# Altium schematic sheet converter.SchDoc
size A4; SheetNumber: 1; SheetTotal: 1
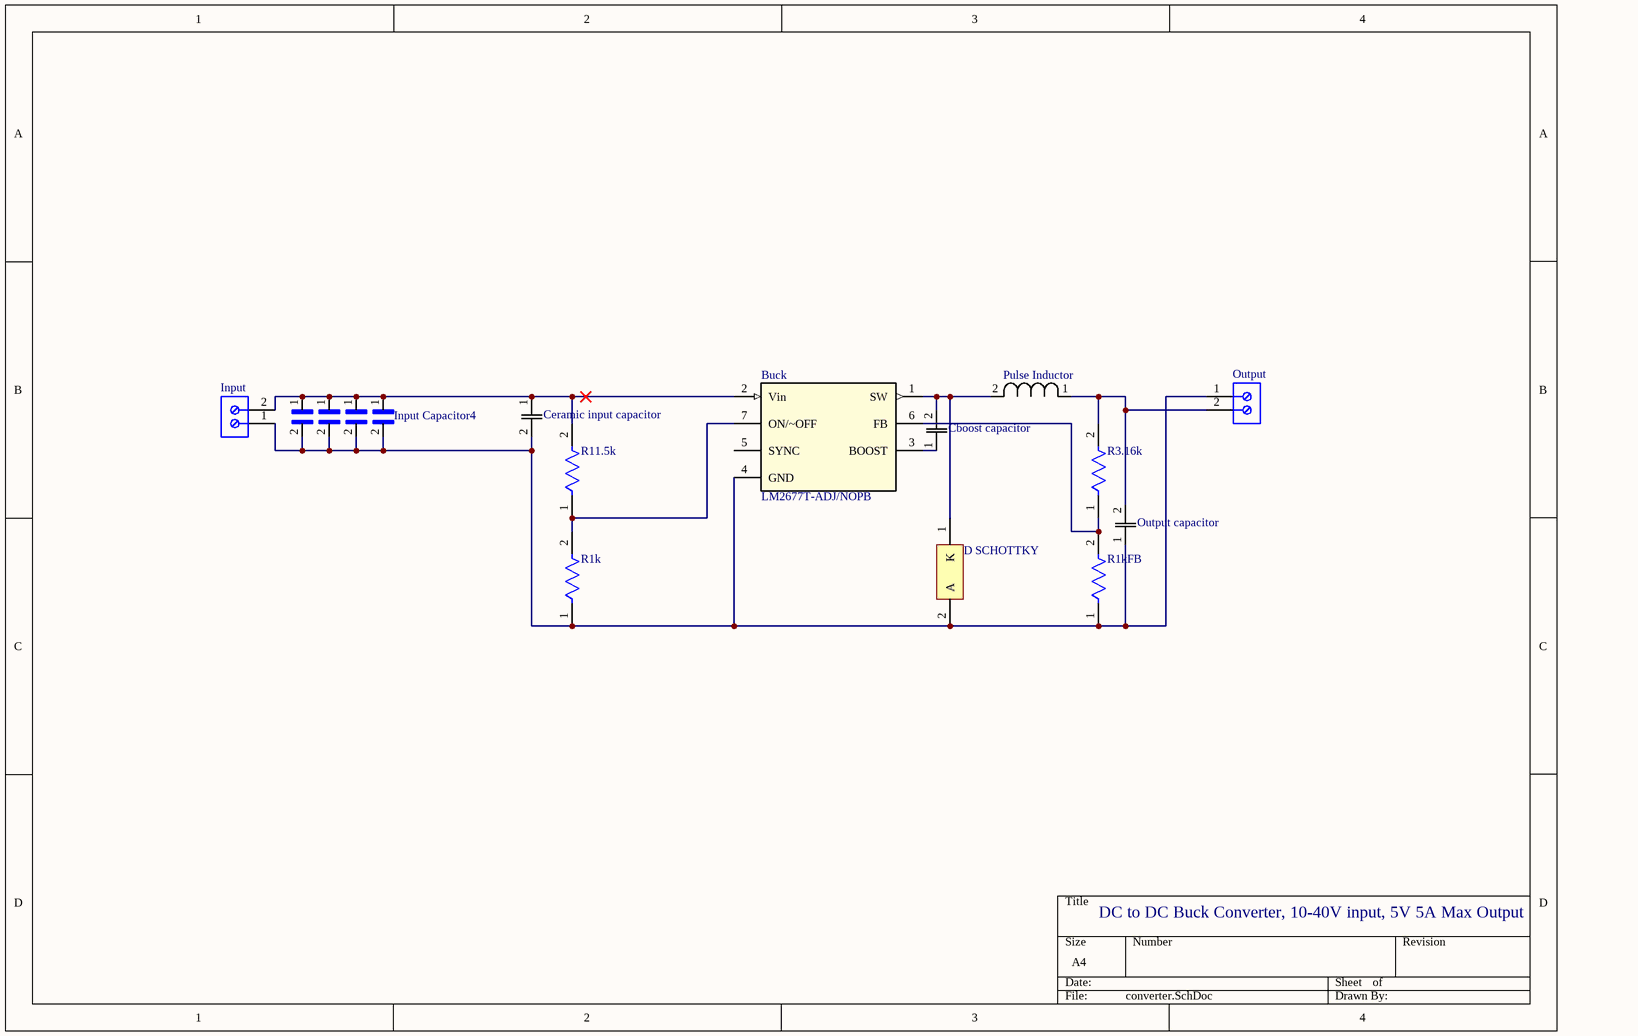
[diagram p0: converter.SchDoc]

## Parts
Buck  LM2677T-ADJ/NOPB  [TA07B]
Cboost_capacitor  VJ1206Y103KXACW1BC  [CAP_VJ1206_VIS]  (value not drawn)
Ceramic_input_capacitor  C0805C334K5RACAUTO  [CAPC220145_100N_KEM]  (value not drawn)
D_SCHOTTKY  80SQ045NRLG  [ONSC-AXIAL_LEAD-2-267-05_V]  (value not drawn)
Input  691137710002  [691137710002]  (value not drawn)
Input_Capacitor1  TPSE156K050R0250  [CAPPM7343X310N]  (value not drawn)
Input_Capacitor2  TPSE156K050R0250  [CAPPM7343X310N]  (value not drawn)
Input_Capacitor3  TPSE156K050R0250  [CAPPM7343X310N]  (value not drawn)
Input_Capacitor4  TPSE156K050R0250  [CAPPM7343X310N]  (value not drawn)
Output  691137710002  [691137710002]  (value not drawn)
Output_capacitor  594D686X9010C2T  [CAP_594D_C_VIS]  (value not drawn)
Pulse_Inductor  PE-54041SNL  [IND_HCI-68_PUL]  (value not drawn)
R1k  CRCW12061K00FKEAHP  [FP-CRCW1206-HPe3-MFG]  (value not drawn)
R1kFB  CRCW12061K00FKEAHP  [FP-CRCW1206-HPe3-MFG]  (value not drawn)
R3.16k  CRCW12063K16FKEA  [FP-CRCW1206-e3-MFG]  (value not drawn)
R11.5k  CRCW120611K5FKEA  [FP-CRCW1206-e3-IPC_C]  (value not drawn)

## Nets
NetBuck_1: Buck.1(SW) Cboost_capacitor.2 D_SCHOTTKY.1(K) Pulse_Inductor.2
NetBuck_2: Buck.2(Vin) Ceramic_input_capacitor.1 Input.2 Input_Capacitor1.1 Input_Capacitor2.1 Input_Capacitor3.1 Input_Capacitor4.1 R11.5k.2
NetBuck_3: Buck.3(BOOST) Cboost_capacitor.1
NetBuck_4: Buck.4(GND) Ceramic_input_capacitor.2 D_SCHOTTKY.2(A) Input.1 Input_Capacitor1.2 Input_Capacitor2.2 Input_Capacitor3.2 Input_Capacitor4.2 Output.1 Output_capacitor.1 R1k.1 R1kFB.1
NetBuck_6: Buck.6(FB) R1kFB.2 R3.16k.1
NetBuck_7: Buck.7(ON/~OFF) R1k.2 R11.5k.1
NetOutput_2: Output.2 Output_capacitor.2 Pulse_Inductor.1 R3.16k.2

Not connected (* = marked no-connect by the designer): Buck 5(SYNC)

## Notes on the sheet
- DC to DC Buck Converter, 10-40V input, 5V 5A Max Output

## Library data of the parts
Buck = LM2677T-ADJ/NOPB: IC REG BUCK ADJ 5A TO220-7; Manufacturer: TI National Semiconductor; Min Input Voltage: 8V; Output Voltage: 37V; Number of Outputs: 1; Max Input Voltage: 40V; Switching Frequency: 260kHz; Quiescent Current: 4.2mA; Output Type: Adjustable; Synchronous Rectifier: No; Efficiency: 84%; Min Output Voltage: 1.21V; Output Configuration: Positive; Supplier 1: Digi-Key; Manufacturer Part Number: LM2677T-ADJ/NOPB; RoHS: Yes; Category: Voltage Regulators - Switching; Stock 1: 20; Pricing 1: 1=6.95000, 10=6.24400, 25=5.90280, 100=5.11580, 250=4.85348, 500=4.35500, 1000=4.33125 (USD); Mount: Through Hole; Case/Package: TO-220; Number of Pins: 7; Min Operating Temperature: -40°C; Max Operating Temperature: 125°C; Packaging: Rail/Tube; Output Current: 5A; Max Output Current: 5A; Package Quantity: 45; Series: SIMPLE SWITCHER®; Operating Supply Voltage: 40V; Max Output Voltage: 37V; Length: 10.16mm; Width: 4.57mm; Height: 8.69mm; Radiation Hardening: No; Lead Free: Lead Free; RoHS Compliant: Yes; ComponentLink1URL: https://datasheet.ciiva.com/6603/lm2677-6603725.pdf?src-supplier=Digi-Key; ComponentLink1Description: https://datasheet.ciiva.com/6603/lm2677-6603725.pdf?src-supplier=Digi-Key; Supplier Part Number 1: LM2677T-ADJ/NOPB-ND
Cboost_capacitor = Cboost capacitor: Cap Ceramic 0.01uF 50V X7R 10% SMD 1206 125C Paper T/R; Manufacturer: Vishay; Capacitance: 10nF; Supplier 1: Digi-Key; Manufacturer Part Number: VJ1206Y103KXACW1BC; RoHS: Yes; Category: Ceramic Capacitors; Stock 1: 755; Pricing 1: 1=0.30000, 10=0.20900, 50=0.13920, 100=0.11830, 500=0.08348, 1000=0.07305 (USD); Mount: Surface Mount; Case/Package: 1206; Case Code (Metric): 3216; Case Code (Imperial): 1206; Min Operating Temperature: -55°C; Max Operating Temperature: 125°C; Package Quantity: 4000; Voltage Rating: 50V; Tolerance: 10%; Packaging: Tape and Reel; Voltage Rating (DC): 50V; Dielectric: X7R; Termination: SMD/SMT; Voltage: 50V; Series: VJ; Construction: Flat; Length: 3.2mm; Width: 0.063inch; Height: 1.9mm; Thickness: 0.037inch; Depth: 1.6mm; Radiation Hardening: No; RoHS Compliant: Yes; ComponentLink1URL: https://datasheet.ciiva.com/178/vjw1bcbascomseries-178176.pdf?src-supplier=Digi-Key; ComponentLink1Description: https://datasheet.ciiva.com/178/vjw1bcbascomseries-178176.pdf?src-supplier=Digi-Key; ComponentLink2URL: https://datasheet.ciiva.com/17445/vjw1bcbascomseries-17445850.pdf?src-supplier=Avnet+Europe; ComponentLink2Description: https://datasheet.ciiva.com/17445/vjw1bcbascomseries-17445850.pdf?src-supplier=Avnet+Europe; ComponentLink3URL: https://datasheet.ciiva.com/16382/vjw1bcbascomseries-16382252.pdf?src-supplier=Future+Electronics; ComponentLink3Description: https://datasheet.ciiva.com/16382/vjw1bcbascomseries-16382252.pdf?src-supplier=Future+Electronics; Supplier Part Number 1: 720-1539-1-ND
Ceramic_input_capacitor = C0805C334K5RACAUTO: Cap Ceramic 0.33uF 50V X7R 10% SMD 0805 125C Paper T/R; Manufacturer: KEMET; Capacitance: 330nF; Supplier 1: Digi-Key; Manufacturer Part Number: C0805C334K5RACAUTO; RoHS: Yes; Category: Ceramic Capacitors; Stock 1: 7177; Pricing 1: 1=0.21000, 10=0.14400, 50=0.08660, 100=0.07320, 500=0.05004, 1000=0.04428 (USD); Mount: Surface Mount; Case/Package: 0805; Case Code (Metric): 2012; Case Code (Imperial): 0805; Contact Plating: Tin,Matte; Dielectric Material: Ceramic; Min Operating Temperature: -55°C; Max Operating Temperature: 125°C; Tolerance: 10%; Voltage Rating: 50V; Packaging: Tape and Reel; Package Quantity: 1; Voltage Rating (DC): 50V; Dielectric: X7R; Termination: SMD/SMT; Series: C; Construction: Flat; Length: 2mm; Width: 0.049inch; Height: 0.9mm; Thickness: 0.039inch; Depth: 1.25mm; Ratings: AEC-Q200; Radiation Hardening: No; REACH SVHC: No SVHC; ComponentLink1URL: https://datasheet.ciiva.com/7842/1776105-7842326.pdf?src-supplier=Element14; ComponentLink1Description: https://datasheet.ciiva.com/7842/1776105-7842326.pdf?src-supplier=Element14; ComponentLink2URL: https://datasheet.ciiva.com/22705/1776105-22705463.pdf?src-supplier=Element14; ComponentLink2Description: https://datasheet.ciiva.com/22705/1776105-22705463.pdf?src-supplier=Element14; Supplier Part Number 1: 399-6959-1-ND
D_SCHOTTKY = CMP-1055-00003-1: Rectifier, 2-Pin Axial_Lead, Pb-Free, Tape and Reel; Manufacturer: On Semiconductor; IFSM Max (A): 140; Configuration: Single; ComponentLink1URL: http://www.onsemi.com/; ComponentLink3Description: Package Specification; PackageVersion: Rev. G, 06/2000; PackageReference: AXIAL_LEAD-2-267-05; ComponentLink1Description: Manufacturer URL; ComponentLink2Description: Datasheet; PackageDescription: 2-Pin, Axial Lead, Diameter 5.05 mm; Mounting Technology: Through Hole; RoHS: TRUE; ComponentLink3URL: http://www.onsemi.com/pub_link/Collateral/267-05.PDF; ComponentLink2URL: http://www.onsemi.cn/pub_link/Collateral/80SQ045N-D.PDF; Packing: Tape and Reel; DatasheetVersion: Rev. 3; PartNumber: 80SQ045NRLG
Input Output = CMP-1502-03324-1: Series 1377 - 5.00 mm Horizontal Entry with Pressure Clamp WR-TBL, 2 pin; Manufacturer: Wurth Elektronik; Pin Number: 2; Pitch: 5.00mm; Operating Temperature: -30to120degC; Package Reference: 691137710002; Publisher: WurthElektronik; Mounting Technology: THT; Manufacturer URL: http://www.we-online.de; Packaging: Box; Part Number: 691137710002; Datasheet URL: http://katalog.we-online.de/pbs/datasheet/691137710002.pdf
Input_Capacitor1-Input_Capacitor4 = Input Capacitor: AVX - TPSE156K050R0250 - Surface Mount Tantalum Capacitor, 15 µF, 50 V, 2917 [7343 Metric], TPS Series, ± 10%, -55 °C; Manufacturer: Kyocera AVX; Capacitance: 15uF; Voltage Rating: 50V; ESR (Equivalent Series Resistance): 250mR; Ripple Current: 325uA; Leakage Current: 5uA; Polarity: Polar; Dissipation Factor: 6%; Supplier 1: Digi-Key; Manufacturer Part Number: TPSE156K050R0250; RoHS: Yes; Category: Tantalum Capacitors; Stock 1: 13; Pricing 1: 1=2.43000, 10=1.96800, 50=1.71740, 100=1.50270 (USD); Mount: Surface Mount,PCB; Case/Package: 7343-43; Number of Pins: 2; Case Code (Metric): 7343; Case Code (Imperial): 2917; Dielectric Material: Tantalum; Min Operating Temperature: -55°C; Max Operating Temperature: 125°C; Tolerance: 10%; Package Quantity: 1; Packaging: Tape and Reel; Voltage Rating (DC): 50V; Termination: SMD/SMT; Voltage: 50V; Features: General Purpose; Series: TPS; Construction: Flat; Length: 7.3mm; Width: 4.3mm; Height: 4.1mm; Height - Seated (Max): 0.169inch; Depth: 4.3mm; Lead Pitch: 4.4mm; Radiation Hardening: No; REACH SVHC: No SVHC; Lead Free: Lead Free; RoHS Compliant: Yes; ComponentLink1URL: https://datasheet.ciiva.com/27052/1408147-27052202.pdf?src-supplier=Jameco; ComponentLink1Description: https://datasheet.ciiva.com/27052/1408147-27052202.pdf?src-supplier=Jameco; ComponentLink2URL: https://datasheet.ciiva.com/26915/getdatasheetpartid-113553-26915162.pdf?src-supplier=Verical; ComponentLink2Description: https://datasheet.ciiva.com/26915/getdatasheetpartid-113553-26915162.pdf?src-supplier=Verical; ComponentLink3URL: https://datasheet.ciiva.com/26341/806578-da-01-en-smd-tantal15uf-50v-10-0-250r-400st-26341830.pdf?src-supplier=Conrad; ComponentLink3Description: https://datasheet.ciiva.com/26341/806578-da-01-en-smd-tantal15uf-50v-10-0-250r-400st-26341830.pdf?src-supplier=Conrad; ComponentLink4URL: https://datasheet.ciiva.com/266/tps-266035.pdf?src-supplier=Digi-Key; ComponentLink4Description: https://datasheet.ciiva.com/266/tps-266035.pdf?src-supplier=Digi-Key; ComponentLink5URL: https://datasheet.ciiva.com/266/tps-266036.pdf?src-supplier=Digi-Key; ComponentLink5Description: https://datasheet.ciiva.com/266/tps-266036.pdf?src-supplier=Digi-Key; ComponentLink6URL: https://datasheet.ciiva.com/266/tps-266037.pdf?src-supplier=Digi-Key; ComponentLink6Description: https://datasheet.ciiva.com/266/tps-266037.pdf?src-supplier=Digi-Key; ComponentLink7URL: https://datasheet.ciiva.com/11230/tps-11230204.pdf?src-supplier=Avnet; ComponentLink7Description: https://datasheet.ciiva.com/11230/tps-11230204.pdf?src-supplier=Avnet; ComponentLink8URL: https://datasheet.ciiva.com/12882/tps-23028-12882493.pdf?src-supplier=Mouser; ComponentLink8Description: https://datasheet.ciiva.com/12882/tps-23028-12882493.pdf?src-supplier=Mouser; ComponentLink9URL: https://datasheet.ciiva.com/17339/tps-17339833.pdf?src-supplier=Avnet+Europe; ComponentLink9Description: https://datasheet.ciiva.com/17339/tps-17339833.pdf?src-supplier=Avnet+Europe; ComponentLink10URL: https://datasheet.ciiva.com/16374/tps-16374888.pdf?src-supplier=Future+Electronics; ComponentLink10Description: https://datasheet.ciiva.com/16374/tps-16374888.pdf?src-supplier=Future+Electronics; ComponentLink11URL: https://datasheet.ciiva.com/7914/1680477-7914799.pdf?src-supplier=Element14; ComponentLink11Description: https://datasheet.ciiva.com/7914/1680477-7914799.pdf?src-supplier=Element14; ComponentLink12URL: https://datasheet.ciiva.com/14593/70001047-14593093.pdf?src-supplier=Allied+Electronics; ComponentLink12Description: https://datasheet.ciiva.com/14593/70001047-14593093.pdf?src-supplier=Allied+Electronics; ComponentLink13URL: https://datasheet.ciiva.com/14605/70001047-14605032.pdf?src-supplier=Allied+Electronics; ComponentLink13Description: https://datasheet.ciiva.com/14605/70001047-14605032.pdf?src-supplier=Allied+Electronics; Supplier Part Number 1: 478-3112-1-ND
Output_capacitor = Output capacitor: CAPACITOR TANT, 68UF, 10V, 0.1 OHM, 0.1, SMD; Capacitance:68µF; Capacitance Tolerance:± 10%; Capacitor Dielectric Type:Tantalum; Capacitor Mounting:SMD; Capacitor Terminals:SMD; ESR:0.1ohm; Filter Terminals:Surface Mount ;RoHS Compliant: Yes; Manufacturer: Vishay Sprague; ESR (Equivalent Series Resistance): 100mR; Ripple Current: 1.05A; Leakage Current: 6.8uA; Polarity: Polar; Dissipation Factor: 6%; Supplier 1: Digi-Key; Manufacturer Part Number: 594D686X9010C2T; RoHS: Yes; Category: Tantalum Capacitors; Stock 1: 706; Pricing 1: 1=3.14000, 10=2.54100, 50=2.21760, 100=1.94040 (USD); Mount: Surface Mount,PCB; Case/Package: 2812; Number of Pins: 2; Case Code (Metric): 7132; Case Code (Imperial): 2812; Dielectric Material: Tantalum; Min Operating Temperature: -55°C; Max Operating Temperature: 125°C; Capacitance: 68uF; Tolerance: 10%; Voltage Rating: 10V; Packaging: Tape and Reel; Package Quantity: 500; Voltage Rating (DC): 10V; Termination: SMD/SMT; Voltage: 10V; Features: General Purpose; Series: 594D; Construction: Flat; Length: 7.1mm; Width: 0.126inch; Height: 2.5mm; Height - Seated (Max): 0.11inch; Depth: 3.2mm; REACH SVHC: Unknown; Lead Free: Lead Free; RoHS Compliant: Yes; ComponentLink1URL: https://datasheet.ciiva.com/11793/0900766b80d97c0f-11793961.pdf?src-supplier=RSComponents; ComponentLink1Description: https://datasheet.ciiva.com/11793/0900766b80d97c0f-11793961.pdf?src-supplier=RSComponents; ComponentLink2URL: https://datasheet.ciiva.com/274/594d-274120.pdf?src-supplier=Digi-Key; ComponentLink2Description: https://datasheet.ciiva.com/274/594d-274120.pdf?src-supplier=Digi-Key; ComponentLink3URL: https://datasheet.ciiva.com/3004/594d-3004965.pdf?src-supplier=Avnet; ComponentLink3Description: https://datasheet.ciiva.com/3004/594d-3004965.pdf?src-supplier=Avnet; ComponentLink4URL: https://datasheet.ciiva.com/3004/594d-3004966.pdf?src-supplier=Avnet; ComponentLink4Description: https://datasheet.ciiva.com/3004/594d-3004966.pdf?src-supplier=Avnet; ComponentLink5URL: https://datasheet.ciiva.com/16632/594d-16632071.pdf?src-supplier=Avnet+Europe; ComponentLink5Description: https://datasheet.ciiva.com/16632/594d-16632071.pdf?src-supplier=Avnet+Europe; ComponentLink6URL: https://datasheet.ciiva.com/16359/594d-16359591.pdf?src-supplier=Future+Electronics; ComponentLink6Description: https://datasheet.ciiva.com/16359/594d-16359591.pdf?src-supplier=Future+Electronics; ComponentLink7URL: https://datasheet.ciiva.com/1463/438286-1463899.pdf?src-supplier=Element14; ComponentLink7Description: https://datasheet.ciiva.com/1463/438286-1463899.pdf?src-supplier=Element14; ComponentLink8URL: https://datasheet.ciiva.com/18444/70212531-18444348.pdf?src-supplier=Allied+Electronics; ComponentLink8Description: https://datasheet.ciiva.com/18444/70212531-18444348.pdf?src-supplier=Allied+Electronics; Supplier Part Number 1: 718-594D686X9010C2TCT-ND
Pulse_Inductor = PE-54041SNL: Inductor Power Wirewound 25uH 20% 3A 40mOhm DCR; Manufacturer: Pulse; Shielding: Unshielded; DC Resistance (DCR): 40mR; Supplier 1: Digi-Key; Manufacturer Part Number: PE-54041SNL; RoHS: Yes; Category: Fixed Inductors; Stock 1: 95; Pricing 1: 1=3.03000, 10=2.77800, 25=2.52480, 50=2.12100, 100=1.81800, 250=1.71700, 500=1.61600, 1000=1.51500, 2500=1.46450 (USD); Mount: Surface Mount; Case/Package: SMD/SMT; Min Operating Temperature: -40°C; Max Operating Temperature: 130°C; Packaging: Bulk; Tolerance: 20%; Package Quantity: 30; Current Rating: 3A; Inductance: 25uH; Max DC Current: 3A; Termination: SMD/SMT; DC Current: 3A; Series: LCI; Length: 17.78mm; Width: 0.67inch; Height: 0.39inch; Depth: 17.02mm; Radiation Hardening: No; Military Standard: Not; Lead Free: Lead Free; RoHS Compliant: Yes; ComponentLink1URL: http://www.mouser.com/ds/2/336/-268328.pdf?src-supplier=Mouser; ComponentLink1Description: http://www.mouser.com/ds/2/336/-268328.pdf?src-supplier=Mouser; ComponentLink2URL: http://components.arrow.com/part/dataview/42118542S8144333N6149?src-supplier=Arrow+Electronics; ComponentLink2Description: http://components.arrow.com/part/dataview/42118542S8144333N6149?src-supplier=Arrow+Electronics; ComponentLink3URL: http://components.arrow.com/part/dataview/0323_01095901?src-supplier=Arrow+Europe; ComponentLink3Description: http://components.arrow.com/part/dataview/0323_01095901?src-supplier=Arrow+Europe; ComponentLink4URL: http://productfinder.pulseeng.com/products/datasheets/SPM2007_47.pdf?src-supplier=Avnet; ComponentLink4Description: http://productfinder.pulseeng.com/products/datasheets/SPM2007_47.pdf?src-supplier=Avnet; ComponentLink5URL: http://productfinder.pulseeng.com/products/datasheets/SPM2007_47.pdf?src-supplier=Digi-Key; ComponentLink5Description: http://productfinder.pulseeng.com/products/datasheets/SPM2007_47.pdf?src-supplier=Digi-Key; ComponentLink6URL: http://ww2.pulseeng.com/products/datasheets/SPM2007_47.pdf?src-supplier=Avnet+Europe; ComponentLink6Description: http://ww2.pulseeng.com/products/datasheets/SPM2007_47.pdf?src-supplier=Avnet+Europe; ComponentLink7URL: https://www.verical.com/server-webapp/html/getDatasheet?partID=180366&src-supplier=Verical; ComponentLink7Description: https://www.verical.com/server-webapp/html/getDatasheet?partID=180366&src-supplier=Verical; Supplier Part Number 1: 553-1424-ND
R1k R1kFB = CMP-2003-04874-2: RES SMD 1K OHM 1% 3/4W 1206; Manufacturer: Vishay; Automotive Grade: Grade 0; Resistance: 1kΩ; Power Rating: 0.75W; Temperature Coefficient: 100ppm/°C; Value: 1kΩ; Voltage Rating: 200V; Category: Res; Tolerance: 1%; Manufacturer Part Number: CRCW12061K00FKEAHP; Mouser Description: Res Thick Film 1206 1K Ohm 1% 0.75W ±100ppm/°C Molded SMD SMD Paper T/R; Octopart: https://octopart.com/crcw12061k00fkeahp-vishay-42635114; Package: CRCW1206-HPe3; Device Class L1: Passive Components; Ipc Land Pattern Name: RESC310160X50; Temperature Range High: +155°C; Lead Free: Yes; Device Class L2: Resistors; RoHS: TRUE; Temperature: -55°C to +155°C; Composition: Thick Film; Height: 0.65mm; Automotive: Yes; ComponentLink2Description: Datasheet; Digikey Description: RES SMD 1K OHM 1% 3/4W 1206; ComponentLink2URL: http://www.vishay.com/docs/20043/crcwhpe3.pdf; Device Class L3: Chip SMD Resistors; Series: CRCW-HP e3; Temperature Range Low: -55°C
R3.16k = CMP-2003-02148-2: RES Thick Film, 3.16kΩ, 1%, 0.25W, 100ppm/°C, 1206; Max Power Dissipation: 250mW; Working Voltage: 200V; Resistance: 3.16kR; Depth: 1.6mm; Tolerance: 1%; Height: 0.55mm; Lead Free: Lead Free; Features: Automotive AEC-Q200; Mount: Surface Mount; Max Operating Temperature: 155°C; Min Operating Temperature: -55°C; Temperature Coefficient: 100ppm/°C; Case Code (Imperial): 1206; Military Standard: Not; Length: 3.2mm; Composition: Thick Film; Contact Plating: Tin; Case Code (Metric): 3216; Weight: 0.000353oz; Case/Package: 1206; Voltage Rating (DC): 200V; Voltage Rating: 200V; Power Rating: 250mW; Termination: SMD/SMT; Radiation Hardening: No; Package Quantity: 10; Width: 1.6mm; Number of Terminations: 2; Packaging: Tape and Reel; Number of Pins: 2
R11.5k = CMP-2003-04832-2: RES Thick Film, 11.5kΩ, 1%, 0.25W, 100ppm/°C, 1206; Voltage Rating: 200V; Power Rating: 250mW; Resistance: 11.5kR; Tolerance: 1%; Contact Plating: Tin; Package Quantity: 10; Max Operating Temperature: 155°C; Termination: SMD/SMT; Features: Automotive AEC-Q200; Width: 1.6mm; Packaging: Tape and Reel; Number of Pins: 2; Weight: 0.000353oz; Composition: Thick Film; Min Operating Temperature: -55°C; Depth: 1.6mm; Case/Package: 1206; Military Standard: Not; Max Power Dissipation: 250mW; Radiation Hardening: No; Temperature Coefficient: 100ppm/°C; Length: 3.2mm; Case Code (Metric): 3216; Number of Terminations: 2; Height: 0.024inch; Case Code (Imperial): 1206; Lead Free: Lead Free; Voltage Rating (DC): 200V